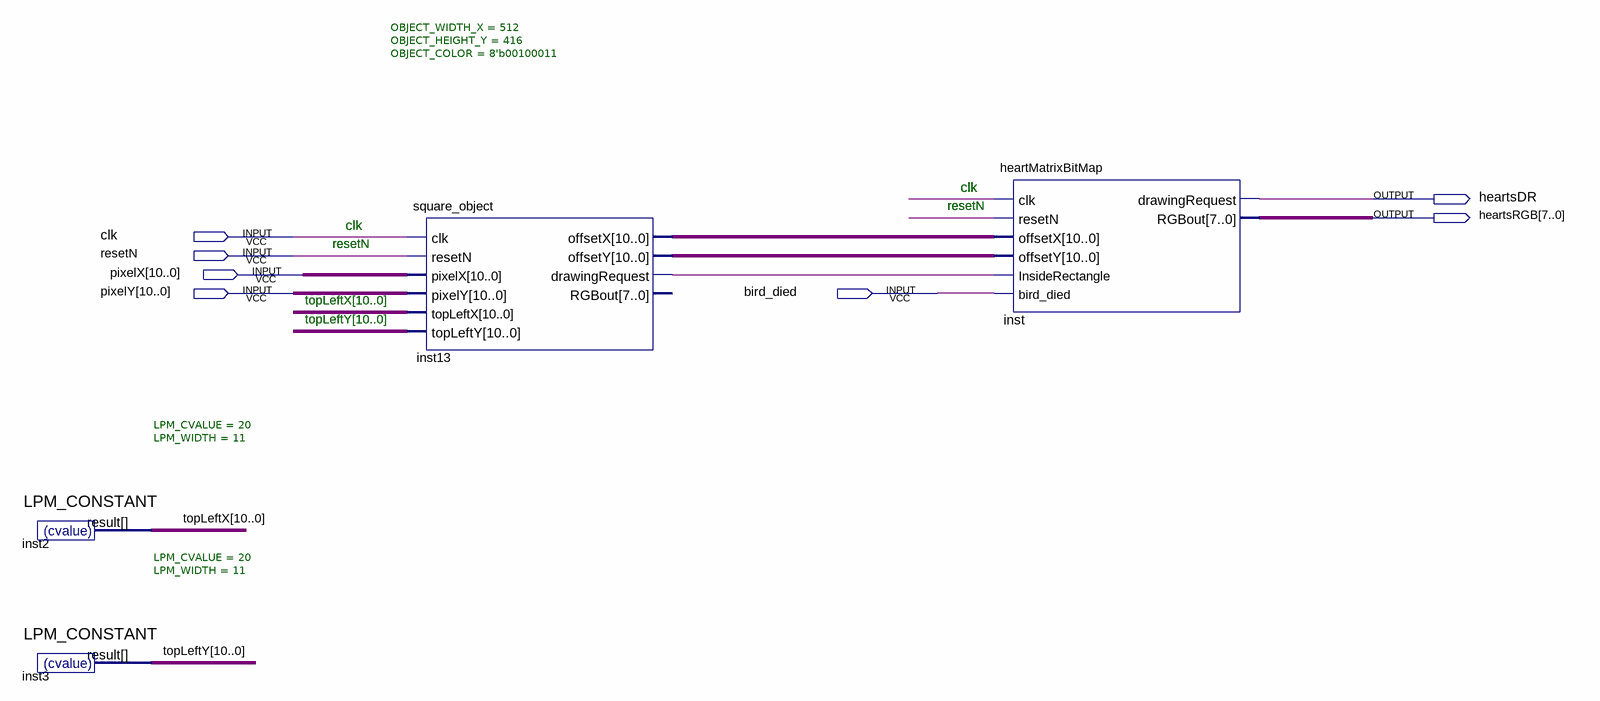
[diagram p0: schematic sheet]
// Quartus schematic Hearts_Block_T.bdf as structural Verilog: 4 symbols, 7 pins
module Hearts_Block_T (
  input  clk,
  input  resetN,
  input  [10:0] pixelX,
  input  [10:0] pixelY,
  input  bird_died,
  output heartsDR,
  output [7:0] heartsRGB
);

  wire inst13_drawingrequest;
  wire [10:0] inst13_offsetx, inst13_offsety, topLeftX, topLeftY;

  LPM_CONSTANT #(.LPM_CVALUE(20), .LPM_WIDTH(11)) inst2 (.result(topLeftX));
  LPM_CONSTANT #(.LPM_CVALUE(20), .LPM_WIDTH(11)) inst3 (.result(topLeftY));
  square_object #(.OBJECT_WIDTH_X(512), .OBJECT_HEIGHT_Y(416), .OBJECT_COLOR(8'b00100011)) inst13 (
    .clk(clk), .resetN(resetN), .pixelX(pixelX), .pixelY(pixelY), .topLeftX(topLeftX), .topLeftY(topLeftY),
    .offsetX(inst13_offsetx), .offsetY(inst13_offsety), .drawingRequest(inst13_drawingrequest));  // open: RGBout
  heartMatrixBitMap inst (
    .clk(clk), .resetN(resetN), .offsetX(inst13_offsetx), .offsetY(inst13_offsety),
    .InsideRectangle(inst13_drawingrequest), .bird_died(bird_died), .drawingRequest(heartsDR),
    .RGBout(heartsRGB));

  // Notes on the sheet:
  //   clk
  //   clk
  //   clk
  //   resetN
  //   resetN
  //   resetN
  //   clk
  //   clk
  //   resetN
  //   resetN
  //   topLeftX[10..0]
  //   topLeftY[10..0]
endmodule
